# Altium schematic sheet RC Transmitter Frontend.SchDoc
size A; SheetNumber: 2; SheetTotal: 2
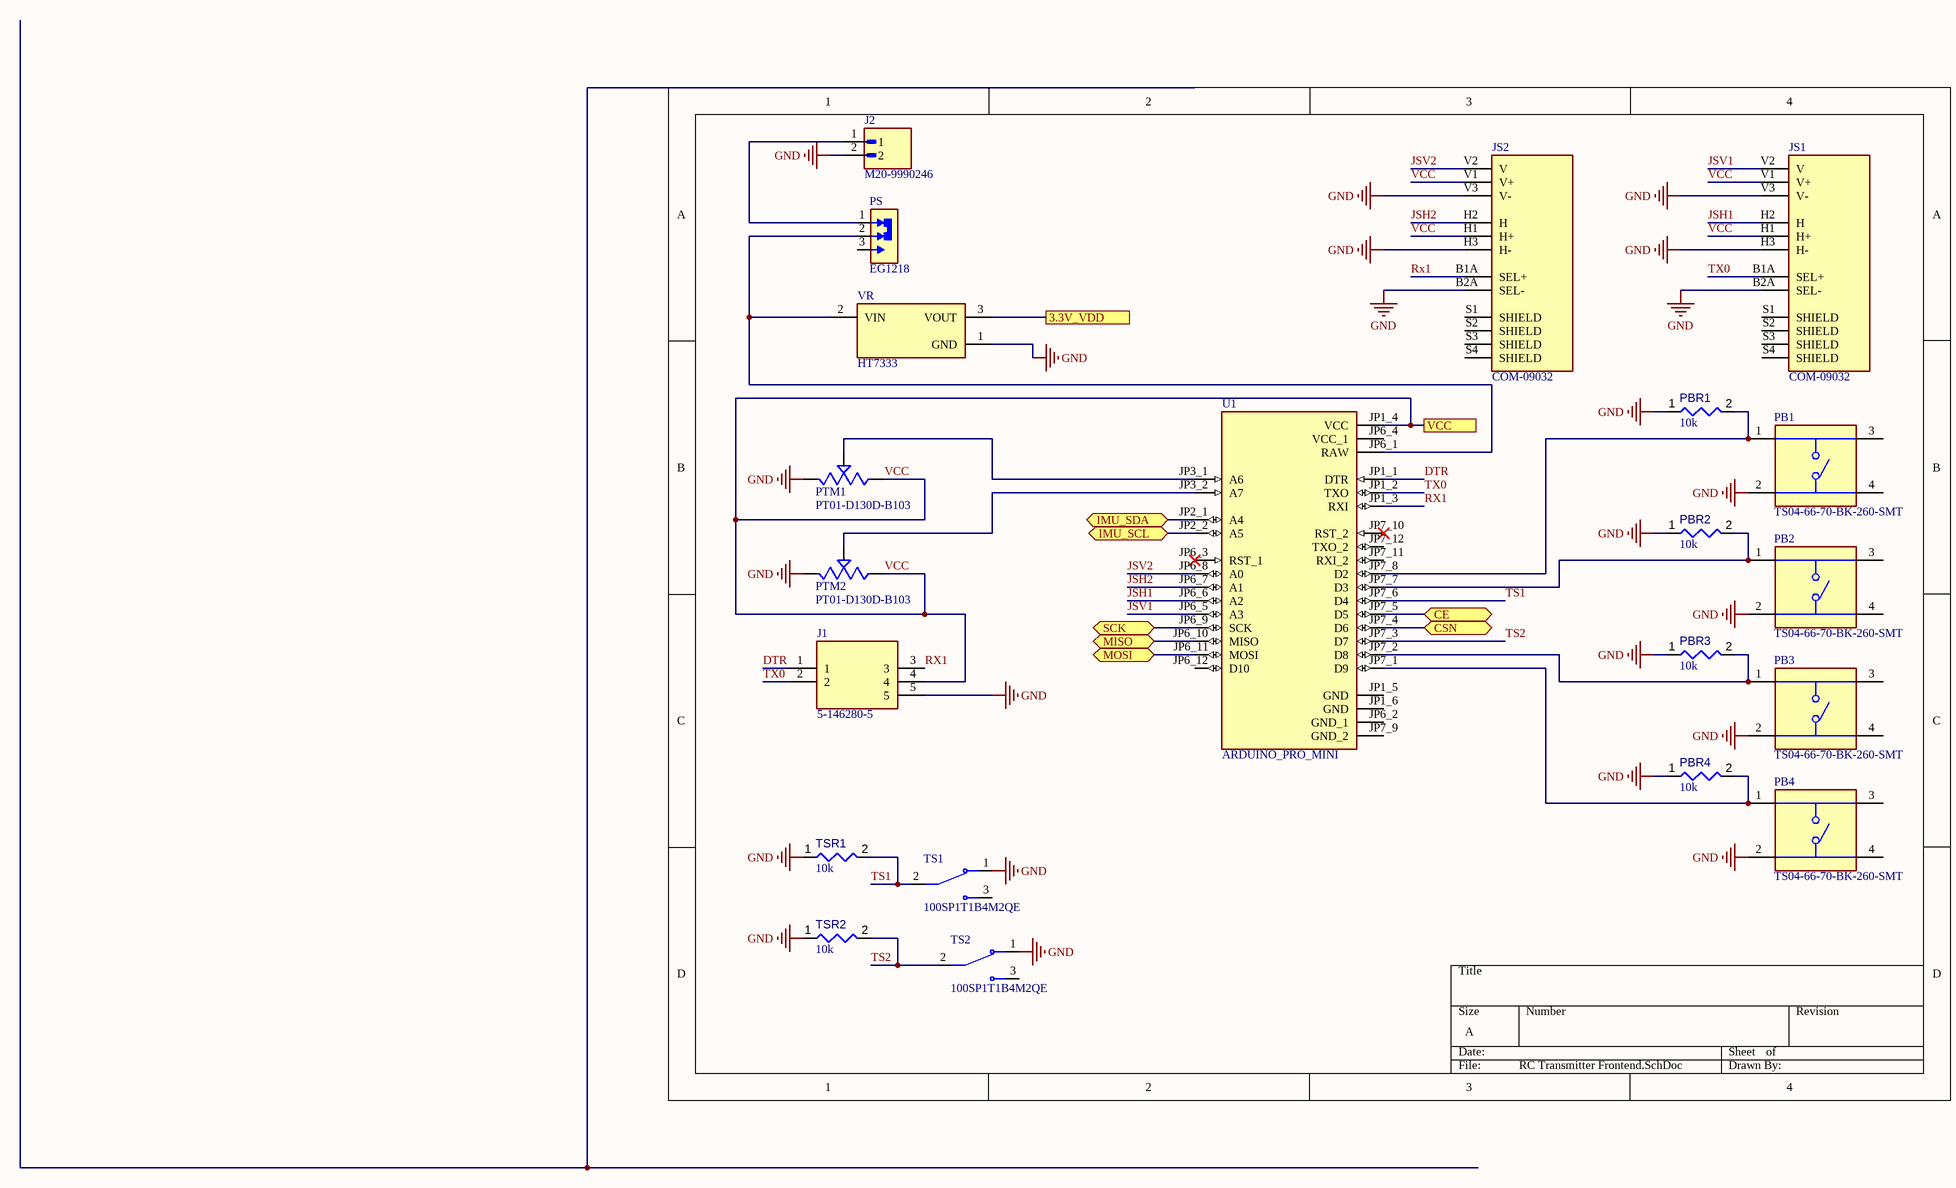
[diagram p0: RC Transmitter Frontend.SchDoc]

## Parts
J1  5-146280-5  [TE_5-146280-5]
J2  M20-9990246  [HARWIN_M20-9990246]
JS1  COM-09032  [XDCR_COM-09032]
JS2  COM-09032  [XDCR_COM-09032]
PB1  TS04-66-70-BK-260-SMT  [SW_TS04-66-70-BK-260-SMT]
PB2  TS04-66-70-BK-260-SMT  [SW_TS04-66-70-BK-260-SMT]
PB3  TS04-66-70-BK-260-SMT  [SW_TS04-66-70-BK-260-SMT]
PB4  TS04-66-70-BK-260-SMT  [SW_TS04-66-70-BK-260-SMT]
PBR1  value 10k  [RESC0402(1005)_L]  (hidden comment: 10KR2F)
PBR2  value 10k  [RESC0402(1005)_L]  (hidden comment: 10KR2F)
PBR3  value 10k  [RESC0402(1005)_L]  (hidden comment: 10KR2F)
PBR4  value 10k  [RESC0402(1005)_L]  (hidden comment: 10KR2F)
PS  EG1218  [SW_EG1218]
PTM1  PT01-D130D-B103  [TRIM_PT01-D130D-B103]
PTM2  PT01-D130D-B103  [TRIM_PT01-D130D-B103]
TS1  100SP1T1B4M2QE  [SW_100SP1T1B4M2QE]
TS2  100SP1T1B4M2QE  [SW_100SP1T1B4M2QE]
TSR1  value 10k  [RESC0402(1005)_L]  (hidden comment: 10KR2F)
TSR2  value 10k  [RESC0402(1005)_L]  (hidden comment: 10KR2F)
U1  ARDUINO_PRO_MINI  [MODULE_ARDUINO_PRO_MINI]
VR  HT7333  [IC_HT7333]

## Ports
3.3V_VDD (see RC Transmitter Backend[4B]), CE (bidir, see RC Transmitter Backend[3B]), CSN (bidir, see RC Transmitter Backend[2B]), IMU_SCL (bidir, see RC Transmitter Backend[2B]), IMU_SDA (bidir, see RC Transmitter Backend[2B]), MISO (bidir, see RC Transmitter Backend[3B]), MOSI (bidir, see RC Transmitter Backend[3C]), SCK (bidir, see RC Transmitter Backend[3B]), VCC (see RC Transmitter Backend[2C])

## Nets
GND: J1.5 J2.2 JS1.B2A(SEL-) JS1.H3(H-) JS1.V3(V-) JS2.B2A(SEL-) JS2.H3(H-) JS2.V3(V-) PB1.2 PB2.2 PB3.2 PB4.2 PBR1.1 PBR2.1 PBR3.1 PBR4.1 PTM1.1 PTM2.1 TS1.1 TS2.1 TSR1.1 TSR2.1 VR.1(GND)
3.3V_VDD: VR.3(VOUT) ; port 3.3V_VDD
CE: U1.JP7_5(D5) ; port CE
CSN: U1.JP7_4(D6) ; port CSN
DTR: J1.1 U1.JP1_1(DTR)
IMU_SCL: U1.JP2_2(A5) ; port IMU_SCL
IMU_SDA: U1.JP2_1(A4) ; port IMU_SDA
JSH1: JS1.H2(H) U1.JP6_6(A2)
JSH2: JS2.H2(H) U1.JP6_7(A1)
JSV1: JS1.V2(V) U1.JP6_5(A3)
JSV2: JS2.V2(V) U1.JP6_8(A0)
MISO: U1.JP6_10(MISO) ; port MISO
MOSI: U1.JP6_11(MOSI) ; port MOSI
RX1: J1.3 JS2.B1A(SEL+) U1.JP1_3(RXI)
SCK: U1.JP6_9(SCK) ; port SCK
TS1: TS1.2 TSR1.2 U1.JP7_6(D4)
TS2: TS2.2 TSR2.2 U1.JP7_3(D7)
TX0: J1.2 JS1.B1A(SEL+) U1.JP1_2(TXO)
VCC: J1.4 JS1.H1(H+) JS1.V1(V+) JS2.H1(H+) JS2.V1(V+) PTM1.3 PTM2.3 U1.JP1_4(VCC) ; port VCC
NetJ2_1: J2.1 PS.1(NC)
NetPB1_1: PB1.1 PBR1.2 U1.JP7_8(D2)
NetPB2_1: PB2.1 PBR2.2 U1.JP7_7(D3)
NetPB3_1: PB3.1 PBR3.2 U1.JP7_2(D8)
NetPB4_1: PB4.1 PBR4.2 U1.JP7_1(D9)
NetPS_2: PS.2(COM) U1.JP6_1(RAW) VR.2(VIN)
NetPTM1_2: PTM1.2 U1.JP3_1(A6)
NetPTM2_2: PTM2.2 U1.JP3_2(A7)

Not connected (* = marked no-connect by the designer): JS1 S1(SHIELD) S2(SHIELD) S3(SHIELD) S4(SHIELD); JS2 S1(SHIELD) S2(SHIELD) S3(SHIELD) S4(SHIELD); PB1 3 4; PB2 3 4; PB3 3 4; PB4 3 4; PS 3(NO); TS1 3; TS2 3; U1 JP1_5(GND) JP1_6(GND) JP6_2(GND_1) JP6_3(RST_1)* JP6_4(VCC_1) JP6_12(D10) JP7_9(GND_2) JP7_10(RST_2)* JP7_11(RXI_2) JP7_12(TXO_2)

## Library data of the parts
J1 = 5-146280-5: 05 MODII HDR SRST B/A .100CL; Package: None; Value: *; Price: None; MP: 5-146280-5; Availability: Unavailable
J2 = M20-9990246: 2.54mm (0.1) Pitch SIL Vertical Throughboard Pin Header, 6.1mm mating pin height, tin, 2 contacts; MF: Harwin; SnapEDA_Link: https://www.snapeda.com/parts/M20-9990246/Harwin/view-part/?ref=snap; Package: None; Value: *; MP: M20-9990246; Check_prices: https://www.snapeda.com/parts/M20-9990246/Harwin/view-part/?ref=eda
JS1 JS2 = COM-09032: Thumb Joystick; Price: None; Availability: Unavailable; MP: COM-09032; Value: *; Package: None
PB1-PB4 = TS04-66-70-BK-260-SMT: 6 x 6 mm, 7 mm Actuator Height, 260 gf, Black, Surface Mount, SPST, Tactile Switch; MF: Same Sky; SnapEDA_Link: https://www.snapeda.com/parts/TS04-66-70-BK-260-SMT/Same+Sky/view-part/?ref=snap; Package: None; Value: *; MP: TS04-66-70-BK-260-SMT; Check_prices: https://www.snapeda.com/parts/TS04-66-70-BK-260-SMT/Same+Sky/view-part/?ref=eda
PBR1-PBR4 TSR1 TSR2 = CMP-009-00066-2: 10K 0.063W 1% 0402 (1005 Metric)  SMD; Power: 63mW; Case/Package: 0402; Mounting Technology: SMT; Pins: 2; Tolerance: 1%
PS = EG1218: Slide Switch, EG Series, SPDT, Non-Shorting, ON-ON, 200mA DC, 30VDC, PC Pin | E-Switch EG1218; SnapEDA_Link: https://www.snapeda.com/parts/EG1218/E-Switch/view-part/?ref=snap; Package: None; Value: *; MF: E-Switch; MP: EG1218; Check_prices: https://www.snapeda.com/parts/EG1218/E-Switch/view-part/?ref=eda
PTM1 PTM2 = PT01-D130D-B103: 10 mm, Vertical, Linear, 10 kÎ©, Through Hole, D-cut Rotary Potentiometer; MF: Same Sky; SnapEDA_Link: https://www.snapeda.com/parts/PT01-D130D-B103/Same+Sky/view-part/?ref=snap; Package: None; Value: *; MP: PT01-D130D-B103; Check_prices: https://www.snapeda.com/parts/PT01-D130D-B103/Same+Sky/view-part/?ref=eda
TS1 TS2 = 100SP1T1B4M2QE: Toggle Switch SPDT Through Hole; Package: None; Price: None; Value: *; MP: 100SP1T1B4M2QE; Availability: Unavailable
U1 = ARDUINO_PRO_MINI: This board was developed for applications and installations where space is premium and projects are made as permanent set ups. Small, available in 3.3 V and 5 V versions, powered by ATmega328P.; MP: Arduino Pro Mini; SnapEDA_Link: https://www.snapeda.com/parts/Arduino%20Pro%20Mini/Arduino/view-part/?ref=snap; Package: None; Value: *; MF: Arduino; Check_prices: https://www.snapeda.com/parts/Arduino%20Pro%20Mini/Arduino/view-part/?ref=eda
VR = HT7333: Three-terminal, low power, high voltage regulator implemented in CMOS technology; MF: Holtek Semiconductor; SnapEDA_Link: https://www.snapeda.com/parts/HT7333/Holtek/view-part/?ref=snap; Package: None; Value: *; MP: HT7333; Check_prices: https://www.snapeda.com/parts/HT7333/Holtek/view-part/?ref=eda